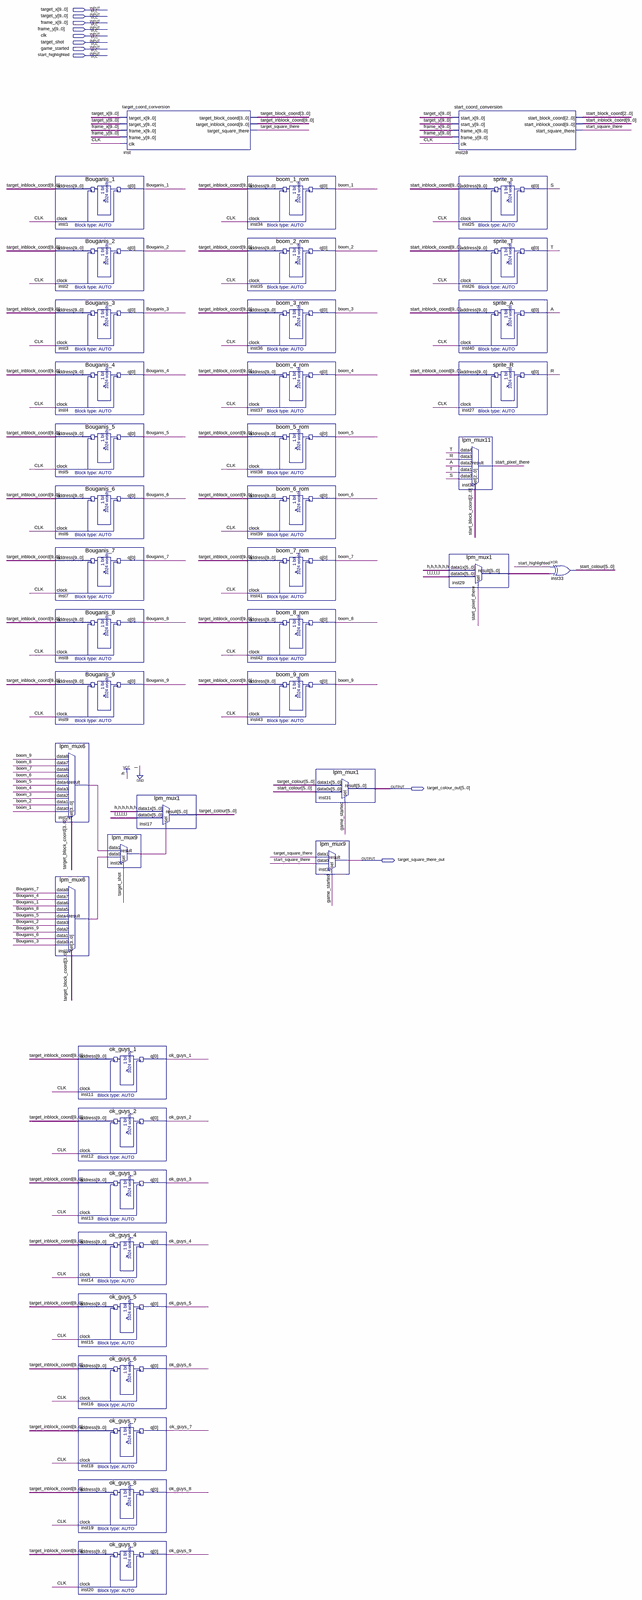
[diagram p0: schematic sheet, whole]
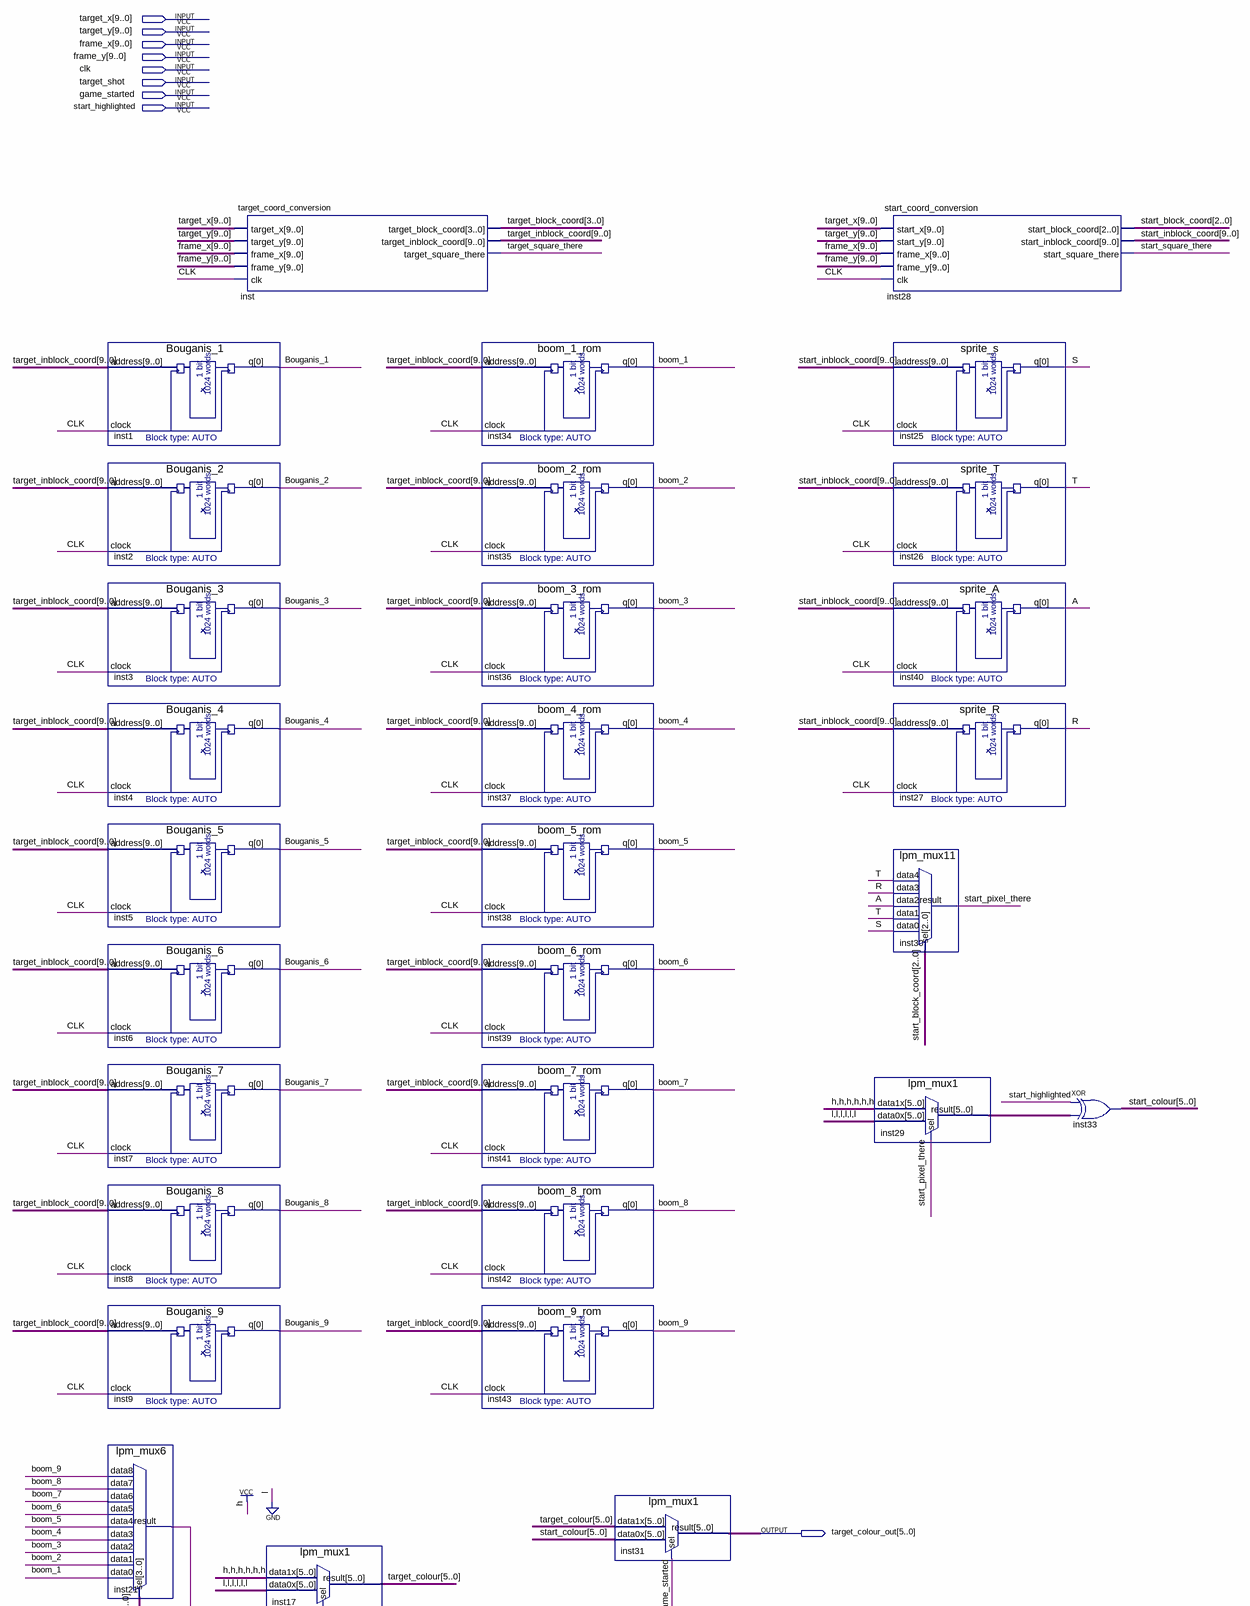
[diagram p1: schematic sheet, upper part]
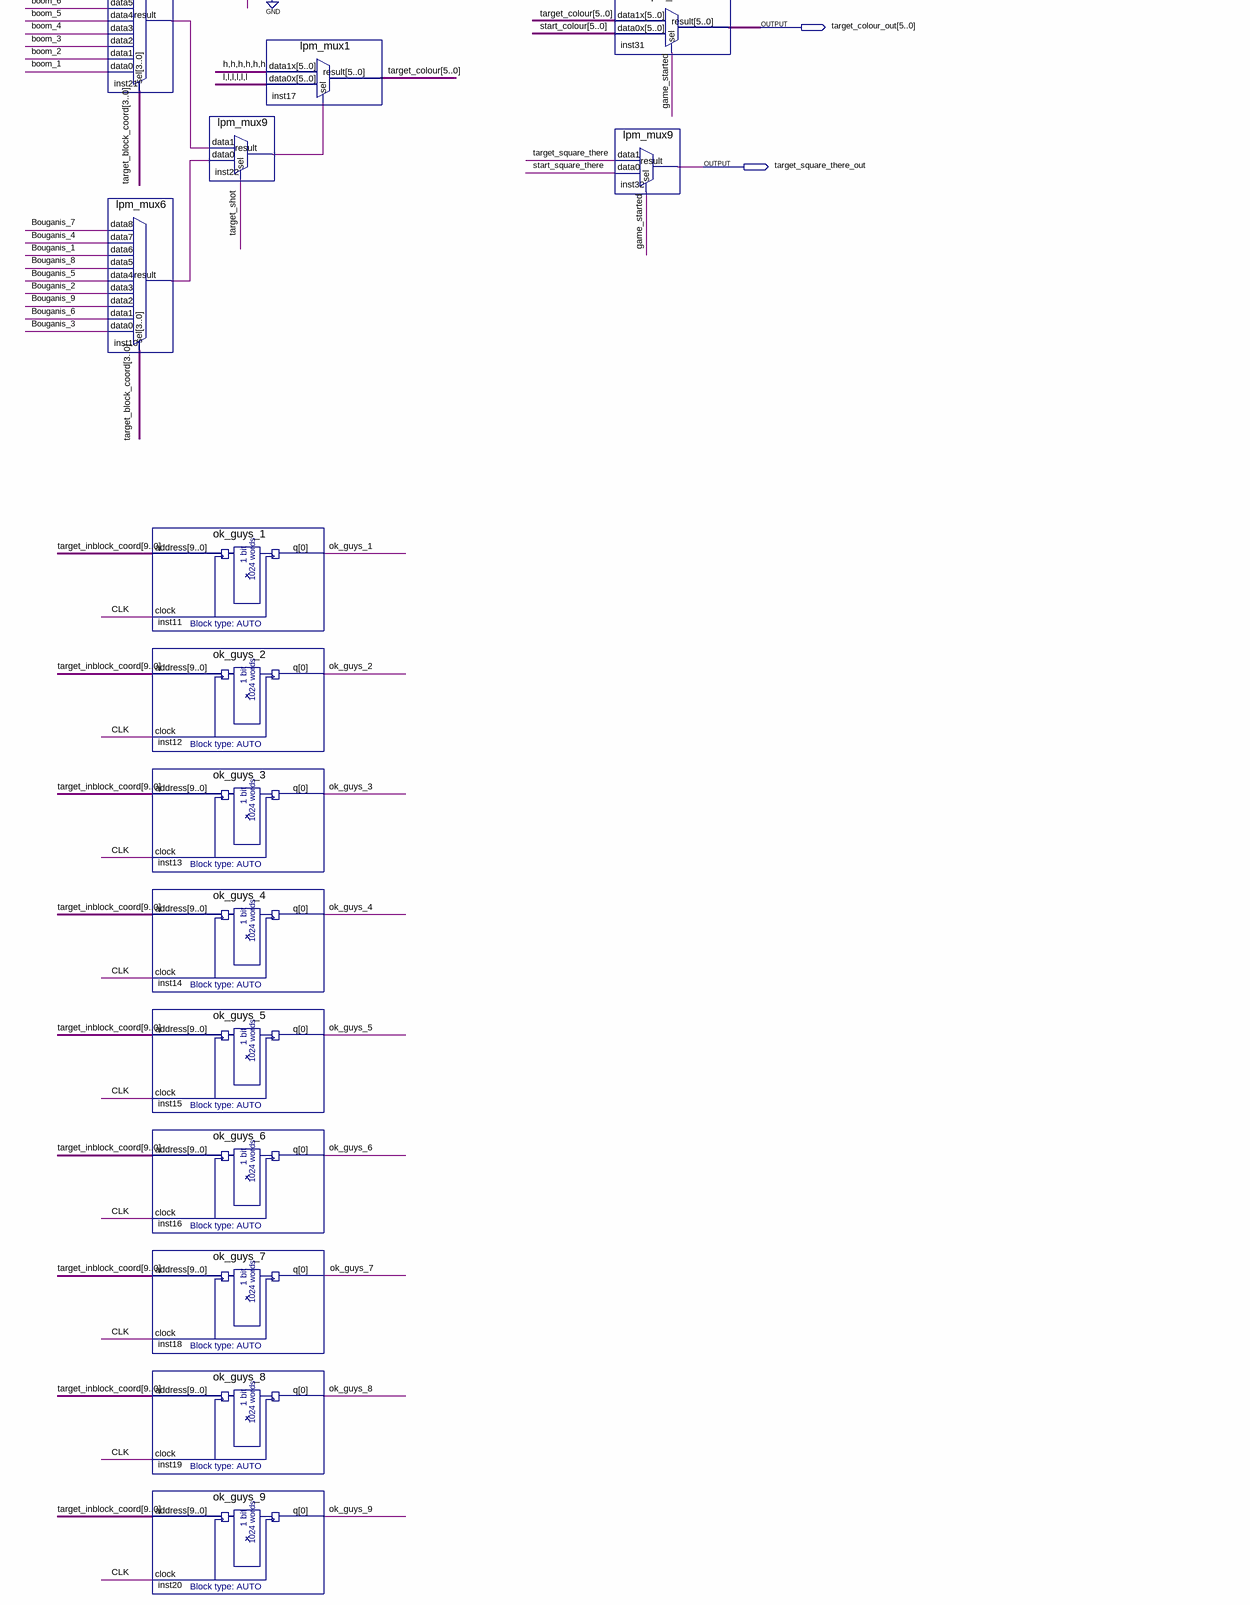
[diagram p2: schematic sheet, lower part]
// Quartus schematic target_display.bdf as structural Verilog: 42 symbols, 10 pins
module target_display (
  input  [9:0] target_x,
  input  [9:0] target_y,
  input  [9:0] frame_x,
  input  [9:0] frame_y,
  input  clk,
  input  target_shot,
  input  game_started,
  input  start_highlighted,
  output [5:0] target_colour_out,
  output target_square_there_out
);

  wire A, boom_1, boom_2, boom_3, boom_4, boom_5, boom_6, boom_7, boom_8, boom_9, Bouganis_1, Bouganis_2,
       Bouganis_3, Bouganis_4, Bouganis_5, Bouganis_6, Bouganis_7, Bouganis_8, Bouganis_9, inst10_result,
       inst21_result, inst22_result, ok_guys_1, ok_guys_2, ok_guys_3, ok_guys_4, ok_guys_5, ok_guys_6,
       ok_guys_7, ok_guys_8, ok_guys_9, R, S, start_pixel_there, start_square_there, T, target_square_there;
  wire [2:0] start_block_coord;
  wire [3:0] target_block_coord;
  wire [5:0] inst29_result, start_colour, target_colour;
  wire [9:0] start_inblock_coord, target_inblock_coord;

  Bouganis_1 inst1 (.address(target_inblock_coord), .clock(clk), .q(Bouganis_1));
  Bouganis_2 inst2 (.address(target_inblock_coord), .clock(clk), .q(Bouganis_2));
  Bouganis_3 inst3 (.address(target_inblock_coord), .clock(clk), .q(Bouganis_3));
  Bouganis_4 inst4 (.address(target_inblock_coord), .clock(clk), .q(Bouganis_4));
  Bouganis_5 inst5 (.address(target_inblock_coord), .clock(clk), .q(Bouganis_5));
  Bouganis_6 inst6 (.address(target_inblock_coord), .clock(clk), .q(Bouganis_6));
  Bouganis_7 inst7 (.address(target_inblock_coord), .clock(clk), .q(Bouganis_7));
  Bouganis_8 inst8 (.address(target_inblock_coord), .clock(clk), .q(Bouganis_8));
  Bouganis_9 inst9 (.address(target_inblock_coord), .clock(clk), .q(Bouganis_9));
  lpm_mux6 inst21 (
    .data8(boom_9), .data7(boom_8), .data6(boom_7), .data5(boom_6), .data4(boom_5), .data3(boom_4),
    .data2(boom_3), .data1(boom_2), .data0(boom_1), .sel(target_block_coord), .result(inst21_result));
  lpm_mux6 inst10 (
    .data8(Bouganis_7), .data7(Bouganis_4), .data6(Bouganis_1), .data5(Bouganis_8), .data4(Bouganis_5),
    .data3(Bouganis_2), .data2(Bouganis_9), .data1(Bouganis_6), .data0(Bouganis_3), .sel(target_block_coord),
    .result(inst10_result));
  ok_guys_1 inst11 (.address(target_inblock_coord), .clock(clk), .q(ok_guys_1));
  ok_guys_2 inst12 (.address(target_inblock_coord), .clock(clk), .q(ok_guys_2));
  ok_guys_3 inst13 (.address(target_inblock_coord), .clock(clk), .q(ok_guys_3));
  ok_guys_4 inst14 (.address(target_inblock_coord), .clock(clk), .q(ok_guys_4));
  ok_guys_5 inst15 (.address(target_inblock_coord), .clock(clk), .q(ok_guys_5));
  ok_guys_6 inst16 (.address(target_inblock_coord), .clock(clk), .q(ok_guys_6));
  ok_guys_7 inst18 (.address(target_inblock_coord), .clock(clk), .q(ok_guys_7));
  ok_guys_8 inst19 (.address(target_inblock_coord), .clock(clk), .q(ok_guys_8));
  ok_guys_9 inst20 (.address(target_inblock_coord), .clock(clk), .q(ok_guys_9));
  target_coord_conversion inst (
    .target_x(target_x), .target_y(target_y), .frame_x(frame_x), .frame_y(frame_y), .clk(clk),
    .target_block_coord(target_block_coord), .target_inblock_coord(target_inblock_coord),
    .target_square_there(target_square_there));
  lpm_mux9 inst22 (.data1(inst21_result), .data0(inst10_result), .sel(target_shot), .result(inst22_result));
  lpm_mux1 inst17 (.data1x({6{1'b1}}), .data0x({6{1'b0}}), .sel(inst22_result), .result(target_colour));
  boom_1_rom inst34 (.address(target_inblock_coord), .clock(clk), .q(boom_1));
  boom_2_rom inst35 (.address(target_inblock_coord), .clock(clk), .q(boom_2));
  boom_3_rom inst36 (.address(target_inblock_coord), .clock(clk), .q(boom_3));
  boom_4_rom inst37 (.address(target_inblock_coord), .clock(clk), .q(boom_4));
  boom_5_rom inst38 (.address(target_inblock_coord), .clock(clk), .q(boom_5));
  boom_6_rom inst39 (.address(target_inblock_coord), .clock(clk), .q(boom_6));
  boom_7_rom inst41 (.address(target_inblock_coord), .clock(clk), .q(boom_7));
  boom_8_rom inst42 (.address(target_inblock_coord), .clock(clk), .q(boom_8));
  boom_9_rom inst43 (.address(target_inblock_coord), .clock(clk), .q(boom_9));
  lpm_mux1 inst31 (.data1x(target_colour), .data0x(start_colour), .sel(game_started), .result(target_colour_out));
  lpm_mux9 inst32 (
    .data1(target_square_there), .data0(start_square_there), .sel(game_started),
    .result(target_square_there_out));
  start_coord_conversion inst28 (
    .start_x(target_x), .start_y(target_y), .frame_x(frame_x), .frame_y(frame_y), .clk(clk),
    .start_block_coord(start_block_coord), .start_inblock_coord(start_inblock_coord),
    .start_square_there(start_square_there));
  sprite_s inst25 (.address(start_inblock_coord), .clock(clk), .q(S));
  sprite_T inst26 (.address(start_inblock_coord), .clock(clk), .q(T));
  sprite_A inst40 (.address(start_inblock_coord), .clock(clk), .q(A));
  sprite_R inst27 (.address(start_inblock_coord), .clock(clk), .q(R));
  lpm_mux11 inst30 (
    .data4(T), .data3(R), .data2(A), .data1(T), .data0(S), .sel(start_block_coord), .result(start_pixel_there));
  lpm_mux1 inst29 (.data1x({6{1'b1}}), .data0x({6{1'b0}}), .sel(start_pixel_there), .result(inst29_result));
  assign start_colour = {6{start_highlighted}} ^ inst29_result;  // XOR inst33, 6 bits wide
endmodule
